# EAGLE design board2 (EAGLE 6.5.0)
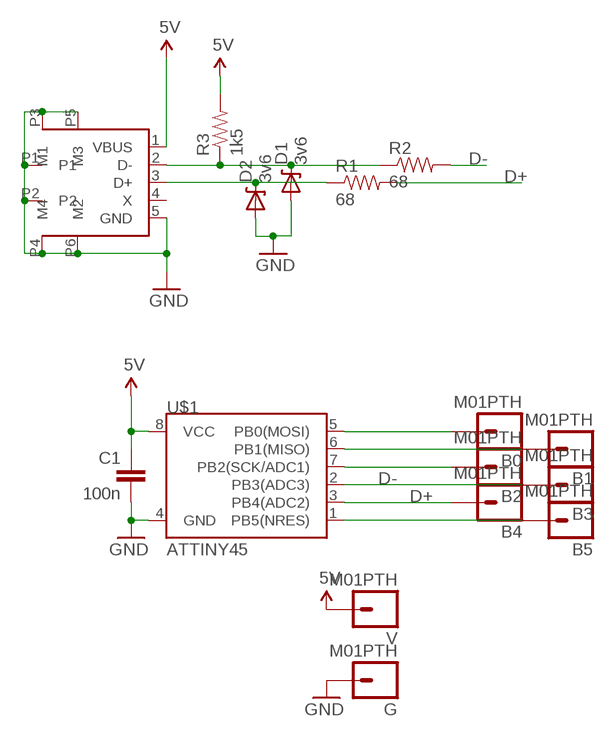
[diagram p0: schematic, sheet 1]

## Parts
B0  M01PTH  [1X01]
B1  M01PTH  [1X01]
B2  M01PTH  [1X01]
B3  M01PTH  [1X01]
B4  M01PTH  [1X01]
B5  M01PTH  [1X01]
C1  100n  CAP0805  [0805]
CON1  USBMICRO-FCI  [USBMINIB-10118194-0001LF]
D1  3v6  DIODE-ZENER-BZT52  [SOD-323]
D2  3v6  DIODE-ZENER-BZT52  [SOD-323]
G  M01PTH  [1X01]
R1  68  RESISTOR0805-RES  [0805]
R2  68  RESISTOR0805-RES  [0805]
R3  1k5  RESISTOR0805-RES  [0805]
U$1  ATTINY45  [SO08-EIAJ]
V  M01PTH  [1X01]

## Nets
5V: C1.1 CON1.1(VBUS) R3.2 U$1.8(VCC) V.1
D+: B4.1 R1.2 U$1.3(PB4(ADC2))
D-: B3.1 R2.2 U$1.2(PB3(ADC3))
GND: C1.2 CON1.5(GND) CON1.P1 CON1.P2 CON1.P3(M1) CON1.P4(M4) CON1.P5(M3) CON1.P6(M2) D1.2(A) D2.2(A) G.1 U$1.4(GND)
N$1: B0.1 U$1.5(PB0(MOSI))
N$2: B1.1 U$1.6(PB1(MISO))
N$3: B2.1 U$1.7(PB2(SCK/ADC1))
N$4: B5.1 U$1.1(PB5(NRES))
N$5: CON1.2(D-) D1.1(C) R2.1 R3.1
N$6: CON1.3(D+) D2.1(C) R1.1
Unconnected: CON1.4(X)

## Library data of the parts
B0 B1-B5 G V = SparkFun-Connectors:M01: Header 1 Standard 1-pin 0.1" header. Use with straight break away headers (SKU : PRT-00116), right angle break away headers (PRT-00553), swiss pins (PRT-00743), machine pins (PRT-00117), and female headers (PRT-00115).
C1 = SparkFun-Passives:CAP: Capacitor Standard 0603 ceramic capacitor, and 0.1" leaded capacitor.
CON1 = 0-sean:USBMICRO-FCI
D1 D2 = SparkFun-DiscreteSemi:DIODE-ZENER: Zener Diode Production Part - 8199 3.4V Zener Voltage
R1-R3 = SparkFun-Passives:RESISTOR: Resistor Basic schematic elements and footprints for 0603, 1206, and PTH resistors.
U$1 = SparkFun-DigitalIC:ATTINY45: Atmel 8-pin 2/4/8kB flash uC

## Board
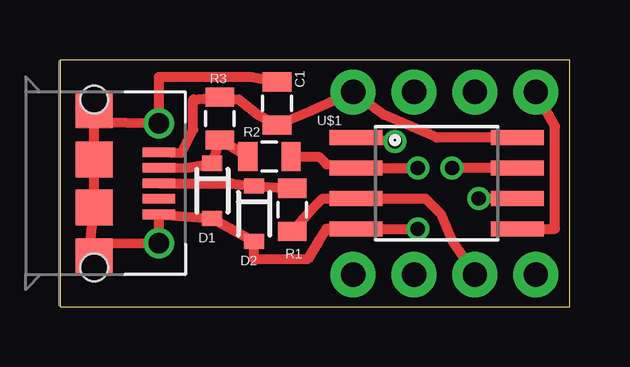
[diagram p1: board, top side]
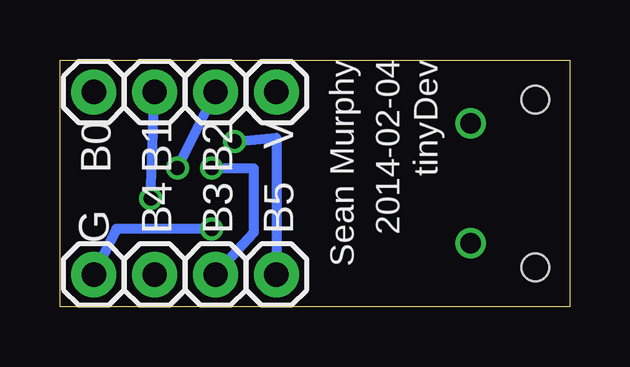
[diagram p2: board, bottom side, seen from below]

Size 21.25 x 10.31 mm. Coordinates in mm from the lower left corner, seen from the top.
Outline: 0,0 21.25,0 21.25,10.31 0,10.31 0,0
Copper layers (1*16): Top 0.0356mm / dielectric 1.5011mm / Bottom 0.0356mm
Design rules "LaenPCBOrder": minimum track width 6mil, minimum drill 13mil, track to track 6mil, track to pad 6mil, pad to pad 6mil, via to via 6mil, smd to smd 6mil, copper to edge 15mil, drill to drill 6mil, minimum pad ring 7mil, minimum via ring 7mil, stop-mask expansion 4mil, vias tented up to drill 0mil, thermal gap 10mil

### Footprints (pad centres in the part's own frame; a part is rotated, then mirrored left to right if it is on the bottom)
1X01 = drill 1.016 pad 1.88: 1 0,0
0805 = smd 0.8 x 1.2: 1 -0.9,0; 2 0.9,0
USBMINIB-10118194-0001LF = smd 0.4 x 1.35: 1 -1.3,2.7; 2 -0.65,2.7; 3 0,2.7; 4 0.65,2.7; 5 1.3,2.7 | smd 1.5 x 1.55: P1 -1,0; P2 1,0; P3 -3.05,0; P4 3.05,0 | drill 0.85 pad 1.25: P5 -2.5,2.7; P6 2.5,2.7 | hole 1.15: -3.5,0; 3.5,0
SOD-323 = smd 0.63 x 0.83: 1 -1.15,0; 2 1.15,0
SO08-EIAJ = smd 0.61 x 2.21: 1 -1.905,-3.378; 2 -0.635,-3.378; 3 0.635,-3.378; 4 1.905,-3.378; 5 1.905,3.353; 6 0.635,3.353; 7 -0.635,3.353; 8 -1.905,3.353

### Placement (x,y rotation side)
B0  19.84,8.97 0 bottom
B1  17.3,8.97 0 bottom
B2  14.76,8.97 0 bottom
B3  14.76,1.35 0 bottom
B4  17.3,1.35 0 bottom
B5  12.22,1.35 0 bottom
C1  9.05,8.49 90 top
CON1  1.43,5.16 270 top
D1  6.35,4.84 270 top
D2  8.1,3.89 270 top
G  19.84,1.35 0 bottom
R1  9.68,4.05 270 top
R2  8.73,6.27 0 top
R3  6.67,7.86 90 top
U$1  15.72,5.16 270 top
V  12.22,8.97 0 bottom

### Tracks (layer width: path | path; a pad name or v marks a point on that pad's centre or on a via)
5V
  Top 0.406: CON1.1 5.08,6.43 5.56,7.38 5.56,8.65 R3.2 7.46,8.65 8.26,8.02 C1.1 10.48,8.18 V.1 13.49,8.02 15.72,7.06 U$1.8
D+
  Top 0.406: R1.2 10.48,4.05 10.95,4.52 U$1.3 15.24,4.52 15.88,3.89 16.35,2.78 B4.1
D-  (via drill 0.6)
  Top 0.406: R2.2 10.79,6.27 11.11,5.95 U$1.2 v14.92,5.79
  Bottom 0.406: v14.92,5.79 13.18,5.79 13.18,3.1 B3.1
GND  (via drill 0.6)
  Top 0.406: 1.27,2.62 CON1.P6 CON1.5 D1.2 D2.2 8.1,1.98 10.32,1.98 10.79,2.78 11.11,3.25 U$1.4 v14.92,3.25 | 1.27,2.62 CON1.P4 | 1.43,7.7 CON1.P5 4.13,9.6 7.94,9.6 C1.2 | 1.43,7.7 CON1.P3 | 1.27,2.62 CON1.P2 CON1.P1 1.43,7.7
  Bottom 0.406: v14.92,3.25 18.89,3.25 G.1
N$1
  Top 0.406: U$1.5 20.64,3.25 20.64,7.54 B0.1
N$2  (via drill 0.6)
  Top 0.406: U$1.6 v17.46,4.52
  Bottom 0.406: v17.46,4.52 B1.1
N$3  (via drill 0.6)
  Top 0.406: U$1.7 v16.35,5.79
  Bottom 0.406: v16.35,5.79 B2.1
N$4  (via drill 0.6)
  Top 0.406: U$1.1 v13.97,6.91
  Bottom 0.406: v13.97,6.91 12.22,7.06 B5.1
N$5
  Top 0.406: CON1.2 5.24,5.79 D1.1 R3.1 R2.1
N$6
  Top 0.406: CON1.3 7.14,5.16 D2.1 R1.1

### Text on the board
bPlace: tinyDev | 2014-02-04 | Sean Murphy